# Altium project TS_23 Dashboard Breakout Board.PrjPcb
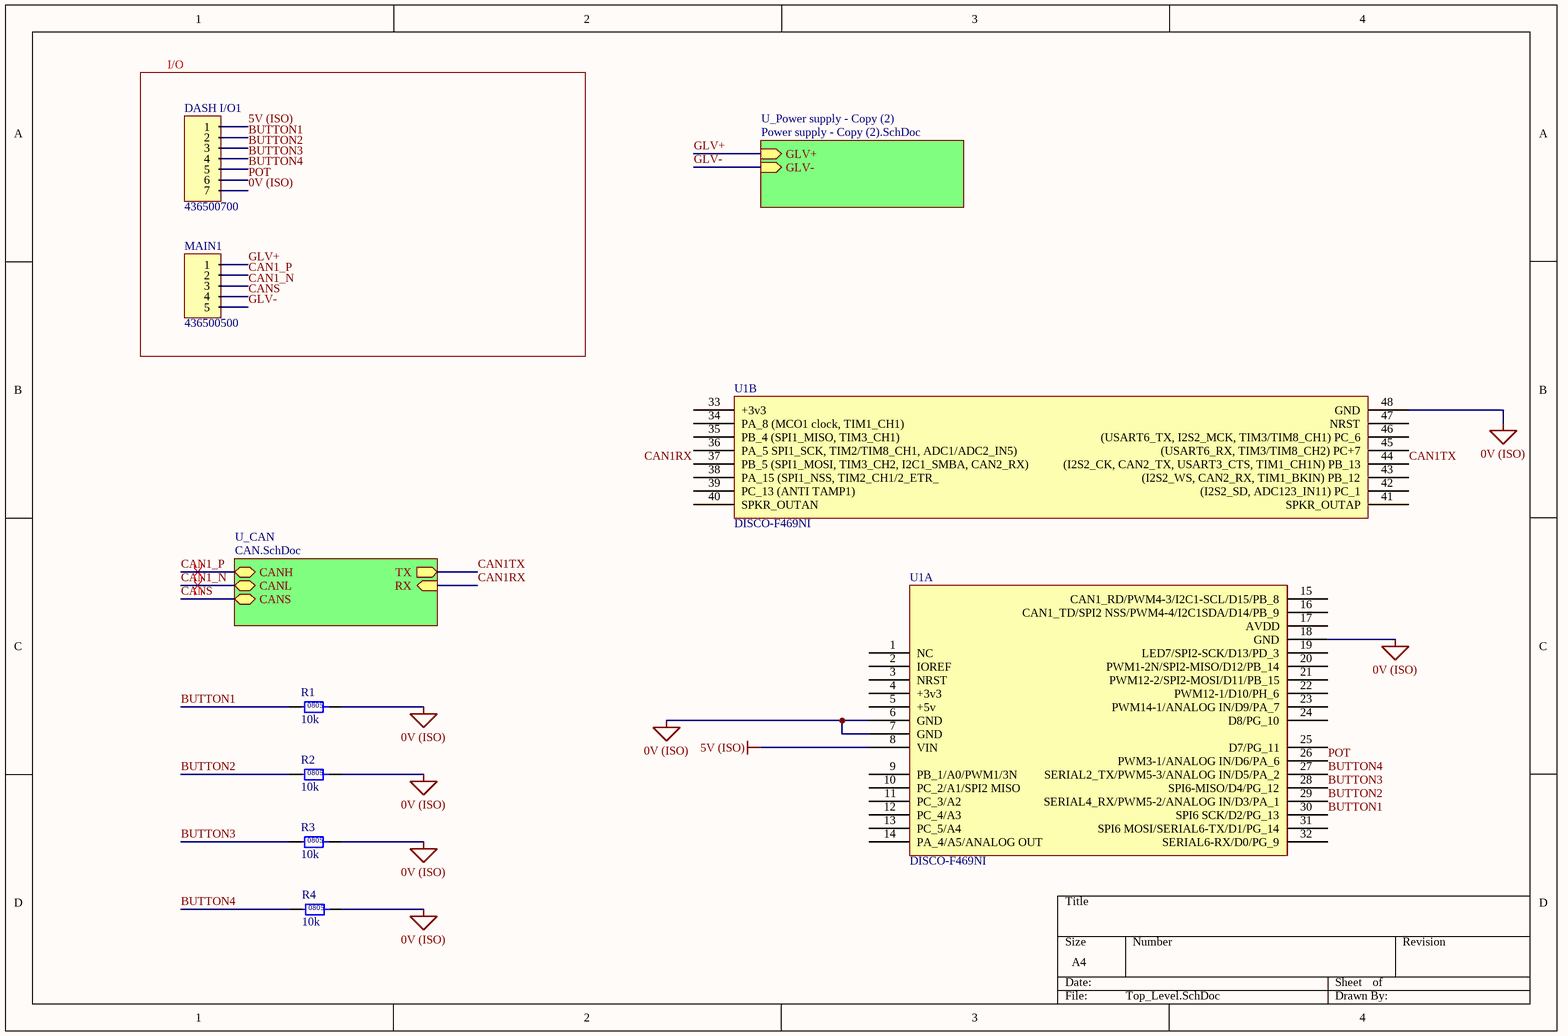
[diagram p0: Top_Level.SchDoc]
3 sheets, 55 parts. Net scope: hierarchical (ports join the sheet entries above them; power ports are global).
Board file: PCB.PcbDoc
Sheets:
  Top_Level.SchDoc
    U_CAN = CAN.SchDoc
    U_Power supply - Copy (2) = Power supply - Copy (2).SchDoc

## Sheet Top_Level.SchDoc
size A4; SheetNumber: 1; SheetTotal: 3

### Parts
DASH_I/O1  436500700  [436500700]
MAIN1  436500500  [436500500]
R1  10k  [0805]
R2  10k  [0805]
R3  10k  [0805]
R4  10k  [0805]
U1  DISCO-F469NI  [DISCO-F469NI]  (parts A,B of 2)

### Blocks framed on the sheet
I/O: DASH_I/O1 MAIN1

### Sub-sheets
U_CAN = CAN.SchDoc: CANH (bidir), CANL (bidir), CANS (bidir), RX (in), TX (out)
U_Power supply - Copy (2) = Power supply - Copy (2).SchDoc: GLV+ (in), GLV- (in)

### Nets
0V (ISO): DASH_I/O1.7 R1.2 R2.2 R3.2 R4.2 U1.6(GND) U1.7(GND) U1.18(GND) U1.48(GND)
5V (ISO): DASH_I/O1.1 U1.8(VIN)
BUTTON1: DASH_I/O1.2 R1.1 U1.30(SPI6_SCK/D2/PG_13)
BUTTON2: DASH_I/O1.3 R2.1 U1.29(SERIAL4_RX/PWM5-2/ANALOG_IN/D3/PA_1)
BUTTON3: DASH_I/O1.4 R3.1 U1.28(SPI6-MISO/D4/PG_12)
BUTTON4: DASH_I/O1.5 R4.1 U1.27(SERIAL2_TX/PWM5-3/ANALOG_IN/D5/PA_2)
CAN1_N: MAIN1.3 ; sheet U_CAN/CANL
CAN1_P: MAIN1.2 ; sheet U_CAN/CANH
CAN1RX: U1.37(PB_5_(SPI1_MOSI,_TIM3_CH2,_I2C1_SMBA,_CAN2_RX)) ; sheet U_CAN/RX
CAN1TX: U1.44((I2S2_CK,_CAN2_TX,_USART3_CTS,_TIM1_CH1N)_PB_13) ; sheet U_CAN/TX
CANS: MAIN1.4 ; sheet U_CAN/CANS
GLV+: MAIN1.1 ; sheet U_Power supply - Copy (2)/GLV+
GLV-: MAIN1.5 ; sheet U_Power supply - Copy (2)/GLV-
POT: DASH_I/O1.6 U1.26(PWM3-1/ANALOG_IN/D6/PA_6)

Not connected (* = marked no-connect by the designer): U1 1(NC) 2(IOREF) 3(NRST) 4(+3v3) 5(+5v) 9(PB_1/A0/PWM1/3N) 10(PC_2/A1/SPI2_MISO) 11(PC_3/A2) 12(PC_4/A3) 13(PC_5/A4) 14(PA_4/A5/ANALOG_OUT) 15(CAN1_RD/PWM4-3/I2C1-SCL/D15/PB_8) 16(CAN1_TD/SPI2_NSS/PWM4-4/I2C1SDA/D14/PB_9) 17(AVDD) 19(LED7/SPI2-SCK/D13/PD_3) 20(PWM1-2N/SPI2-MISO/D12/PB_14) 21(PWM12-2/SPI2-MOSI/D11/PB_15) 22(PWM12-1/D10/PH_6) 23(PWM14-1/ANALOG_IN/D9/PA_7) 24(D8/PG_10) 25(D7/PG_11) 31(SPI6_MOSI/SERIAL6-TX/D1/PG_14) 32(SERIAL6-RX/D0/PG_9) 33(+3v3) 34(PA_8_(MCO1_clock,_TIM1_CH1)) 35(PB_4_(SPI1_MISO,_TIM3_CH1)) 36(PA_5_SPI1_SCK,_TIM2/TIM8_CH1,_ADC1/ADC2_IN5)) 38(PA_15_(SPI1_NSS,_TIM2_CH1/2_ETR_) 39(PC_13_(ANTI_TAMP1)) 40(SPKR_OUTAN) 41(SPKR_OUTAP) 42((I2S2_SD,_ADC123_IN11)_PC_1) 43((I2S2_WS,_CAN2_RX,_TIM1_BKIN)_PB_12) 45((USART6_RX,_TIM3/TIM8_CH2)_PC+7) 46((USART6_TX,_I2S2_MCK,_TIM3/TIM8_CH1)_PC_6) 47(NRST)

### Layout directives
differential pair: CAN1_N, CAN1_P

### Notes on the sheet
- (in symbol RC0805FR0710KL) 0805

### Library data of the parts
DASH_I/O1 = 436500700: Micro-Fit 7x1; Positions: 7; Pitch: 3.0mm; Angle: 90; Flange: No; Contact: Tin; Part Number: 436500700; Row Spacing: 3.0mm; Digikey Part Number: WM2423-ND; Digikey Link: https://www.digikey.com.au/en/products/detail/molex/0436500700/531339
MAIN1 = 436500500: Micro-Fit 5x1; Positions: 5; Pitch: 3.0mm; Angle: 90; Flange: No; Contact: Tin; Part Number: 436500500; Row Spacing: 3.0mm; Digikey Part Number: WM1863-ND; Digikey Link: https://www.digikey.com.au/en/products/detail/molex/0436500500/268992
R1-R4 = RC0805FR0710KL: Manufacturer: YAGEO; Tolerance: 0.01; Rated Power: 0.125W; Part Number: RC0805FR0710KL; Value: 10k; Material: FR-07; Digikey Part Number: 311-10.0KCRCT-ND
U1 = DISCO-F469NI: STM32F469 Discovery STM32F4 ARM® Cortex®-M4 MCU 32-Bit Embedded Evaluation Board  (The Disco 69 lol); Manufacturer: STMicroelectronics; Part Number: DISCO-F469NI; Digikey Part Number: 497-15990-ND; Digikey Link: https://www.digikey.com/product-detail/en/stmicroelectronics/STM32F469I-DISCO/497-15990-ND/5428811

## Sheet CAN.SchDoc
size A4; SheetNumber: 3; SheetTotal: 2
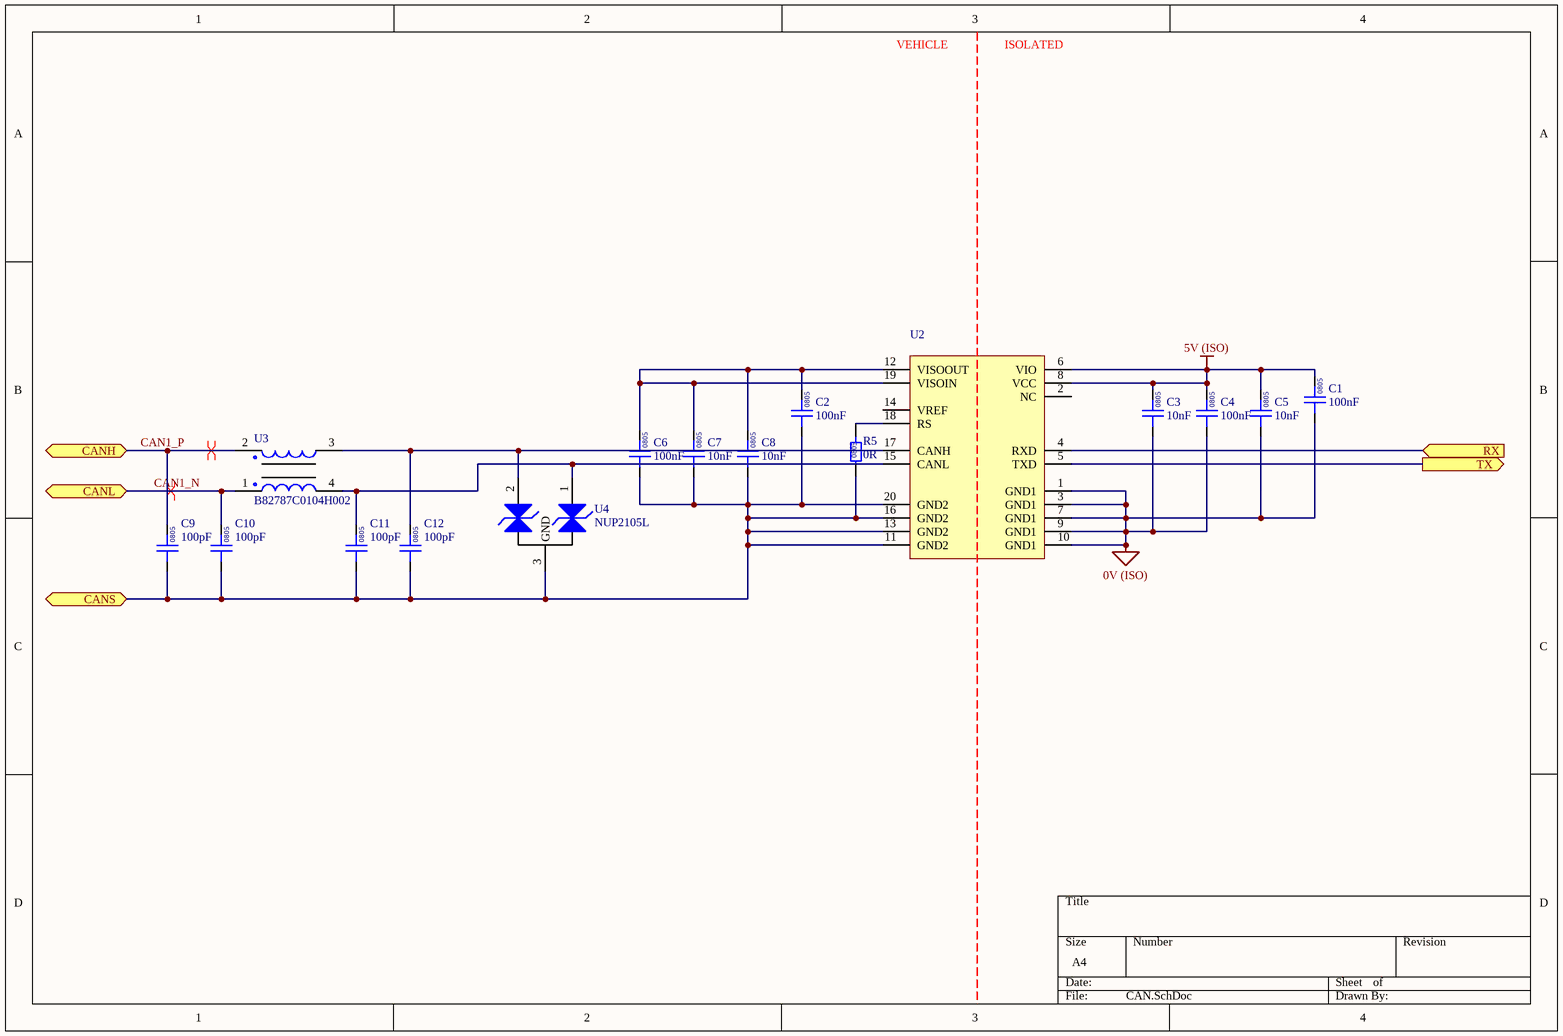
[diagram p1: CAN.SchDoc]

### Parts
C1  100nF  [0805]
C2  100nF  [0805]
C3  10nF  [0805]
C4  100nF  [0805]
C5  10nF  [0805]
C6  100nF  [0805]
C7  10nF  [0805]
C8  10nF  [0805]
C9  100pF  [0805]
C10  100pF  [0805]
C11  100pF  [0805]
C12  100pF  [0805]
R5  0R  [0805]
U2  (no value)  [AD SOIC-W 20]
U3  B82787C0104H002  [TDK 4-PC Pad]
U4  NUP2105L  [ON SOT-23]

### Ports
CANH (bidir), CANL (bidir), CANS (bidir), RX (in), TX (out)

### Nets
0V (ISO): C1.1 C3.1 C4.1 C5.1 U2.1(GND1) U2.3(GND1) U2.7(GND1) U2.9(GND1) U2.10(GND1)
5V (ISO): C1.2 C3.2 C4.2 C5.2 U2.6(VIO) U2.8(VCC)
CAN1_N: C10.2 U3.1 ; port CANL
CAN1_P: C9.2 U3.2 ; port CANH
CAN1RX: U2.4(RXD) ; port RX
CAN1TX: U2.5(TXD) ; port TX
CANS: C2.1 C6.1 C7.1 C8.1 C9.1 C10.1 C11.1 C12.1 R5.1 U2.11(GND2) U2.13(GND2) U2.16(GND2) U2.20(GND2) U4.3(GND) ; port CANS
NetC2_2: C2.2 C6.2 C7.2 C8.2 U2.12(VISOOUT) U2.19(VISOIN)
NetC11_2: C11.2 U2.15(CANL) U3.4 U4.1(CAN_H)
NetC12_2: C12.2 U2.17(CANH) U3.3 U4.2(CAN_L)
NetR5_2: R5.2 U2.18(RS)

Not connected (* = marked no-connect by the designer): U2 2(NC) 14(VREF)

### Layout directives
differential pair: CAN1_N, CAN1_P

### Notes on the sheet
- VEHICLE
- ISOLATED
- (in symbol GCM21BR71H104KA37L) 0805
- (in symbol GCM2165C1H101JA16D) 0805
- (in symbol GCM2195C1H103JA16D) 0805
- (in symbol RC0805FR070RL) 0805

### Library data of the parts
C1 C2 C4 C6 = GCM21BR71H104KA37L: Manufacturer: muRata; Tolerance: ±10%; Material: MLCC; Rated Voltage: 50V; Temperature Rating: X7R; Part Number: GCM21BR71H104KA37L; Value: 100nF; Digikey Part Number: 490-6064-1-ND
C3 C5 C7 C8 = GCM2195C1H103JA16D: Manufacturer: muRata; Tolerance: ±5%; Material: MLCC; Rated Voltage: 50V; Temperature Rating: C0G, NP0; Part Number: GCM2195C1H103JA16D; Value: 10nF; Digikey Part Number: 490-4783-1-ND
C9-C12 = GCM2165C1H101JA16D: Manufacturer: muRata; Tolerance: ±5%; Material: MLCC; Rated Voltage: 50V; Temperature Rating: C0G, NP0; Part Number: GCM2165C1H101JA16D; Value: 100pF; Digikey Part Number: 490-8031-1-ND
R5 = RC0805FR070RL: Manufacturer: YAGEO; Tolerance: 0.01; Rated Power: 0.125W; Part Number: RC0805FR070RL; Value: 0R; Material: FR-07; Digikey Part Number: 311-0.0CRCT-ND
U2 = ADM3053: Isolated CAN Transceiver; Manufacturer: Analogue Devices; Part Number: ADM3053; Digikey Part Number: ADM3053BRWZ-ND; Digikey Link: https://www.digikey.com/product-detail/en/analog-devices-inc/ADM3053BRWZ/ADM3053BRWZ-ND/2709332
U3 = B82787C0104H002: Manufacturer: EPCOS (TDK); Value: 100µH @ 100kHz; Impedance: 5.8 kOhms @ 10MHz; Rated Current: 150mA; Part Number: B82787C0104H002; Material: Wirewound; Digikey Part Number: 495-4598-1-ND
U4 = NUP2105L: Dual Line CAN Bus Protector; Manufacturer: ON Semiconductor; Part Number: NUP2105L; Digikey Part Number: NUP2105LT1GOSCT-ND; Digikey Link: https://www.digikey.com/product-detail/en/on-semiconductor/NUP2105LT1G/NUP2105LT1GOSCT-ND/1485001

## Sheet Power supply - Copy (2).SchDoc
size A4; SheetNumber: 2; SheetTotal: 3
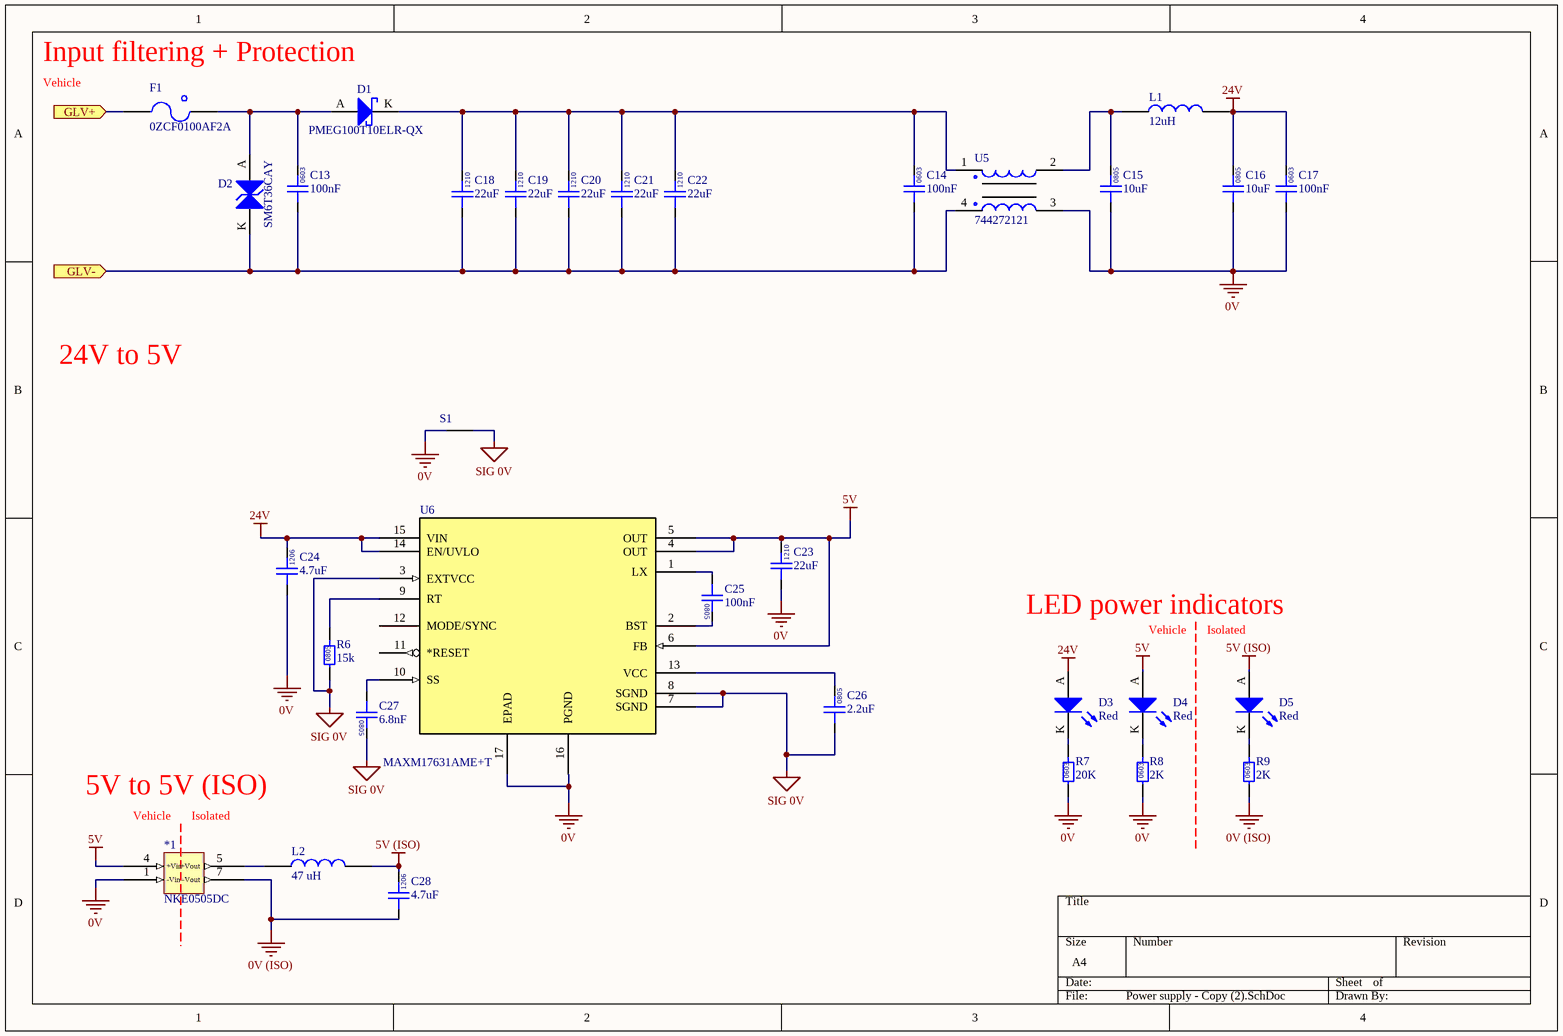
[diagram p2: Power supply - Copy (2).SchDoc]

### Parts
*1  NKE0505DC  [NKE0505DC]
C13  100nF  [0603]
C14  100nF  [0603]
C15  10uF  [0805]
C16  10uF  [0805]
C17  100nF  [0603]
C18  22uF  [1210]
C19  22uF  [1210]
C20  22uF  [1210]
C21  22uF  [1210]
C22  22uF  [1210]
C23  22uF  [1210]
C24  4.7uF  [1206 CAP]
C25  100nF  [0805]
C26  2.2uF  [0805]
C27  6.8nF  [0805]
C28  4.7uF  [1206 CAP]
D1  PMEG100T10ELR-QX  [NXP SOD123W]
D2  SM6T36CAY  [ST SMB DIODE]
D3  Red  [0805 LED]
D4  Red  [0805 LED]
D5  Red  [0805 LED]
F1  0ZCF0100AF2A  [2920]
L1  12uH  [1812]
L2  47 uH  [82473C]
R6  15k  [0805]
R7  20K  [0603]
R8  2K  [0603]
R9  2K  [0603]
S1  (no value)  [POINT_0_1]  (net tie, no BOM)
U5  744272121  [Wurth 4-PC Pad]
U6  MAXM17631AME+T  [MAXM17631AME+T]

### Ports
GLV+ (in), GLV- (in)

### Nets
0V: *1.1(-Vin) C15.1 C16.1 C17.1 C23.1 C24.1 R7.1 R8.1 S1.1 U5.3 U6.16(PGND) U6.17(EPAD)
0V (ISO): *1.7(-Vout) C28.1 R9.1
5V: *1.4(+Vin) C23.2 D4.A U6.4(OUT) U6.5(OUT) U6.6(FB)
5V (ISO): C28.2 D5.A L2.1
24V: C16.2 C17.2 C24.2 D3.A L1.1 U6.14(EN/UVLO) U6.15(VIN)
SIG 0V: C26.1 C27.2 R6.1 S1.2 U6.3(EXTVCC) U6.7(SGND) U6.8(SGND)
GLV+: F1.1 ; port GLV+
GLV-: C13.1 C14.1 C18.1 C19.1 C20.1 C21.1 C22.1 D2.K U5.4 ; port GLV-
Net*1_5: *1.5(+Vout) L2.2
NetC13_2: C13.2 D1.A D2.A F1.2
NetC14_2: C14.2 C18.2 C19.2 C20.2 C21.2 C22.2 D1.K U5.1
NetC15_2: C15.2 L1.2 U5.2
NetC25_1: C25.1 U6.1(LX)
NetC25_2: C25.2 U6.2(BST)
NetC26_2: C26.2 U6.13(VCC)
NetC27_1: C27.1 U6.10(SS)
NetD3_K: D3.K R7.2
NetD4_K: D4.K R8.2
NetD5_K: D5.K R9.2
NetR6_2: R6.2 U6.9(RT)

Not connected (* = marked no-connect by the designer): U6 11(*RESET) 12(MODE/SYNC)

### Notes on the sheet
- Input filtering + Protection
- Vehicle
- 24V to 5V
- Star point grounding for signal GND
- LED power indicators
- Isolated
- (near U6) Css (soft start capacitor) tss = (Css/(5.55*10^-6)) = 1.225ms
- 5V to 5V (ISO)
- (near *1) Vehicle
- (in symbol GCM21BR71H104KA37L) 0805
- (in symbol GCM188L81H104KA57D) 0603
- (in symbol GCM2195C1H682JA16D) 0805
- (in symbol GRM21BR6YA106KE43L) 0805
- (in symbol GRM21BR71E225KE11L) 0805
- (in symbol GRM31CR71H475KA12K) 1206
- (in symbol GRM32ER71E226KE15L) 1210
- (in symbol RC0603FR-072KL) 0603
- (in symbol RC0603FR-0720KL) 0603
- (in symbol RC0805FR0715KL) 0805

### Library data of the parts
*1 = NKE0505DC: DC DC CONVERTER 5V 1W; Manufacturer: Murata Power Solutions Inc.; Input Voltage: 4.5 to 5.5; Output Current: 200 mA; Part Number: NKE0505DC; Output Voltage: 5V; Digikey Part Number: 811-1433-5-ND
C13 C14 C17 = GCM188L81H104KA57D: Manufacturer: muRata; Rated Voltage: 50V; Tolerance: ±10%; Material: MLCC; Temperature Rating: X8L; Part Number: GCM188L81H104KA57D; Value: 100nF; Digikey Part Number: 490-6049-1-ND
C15 C16 = GRM21BR6YA106KE43L: Manufacturer: muRata; Rated Voltage: 50V; Tolerance: 10%; Material: MLCC; Temperature Rating: X5R; Part Number: GRM21BR6YA106KE43L; Value: 10uF; Digikey Part Number: 490-10514-6-ND
C18-C23 = GRM32ER71E226KE15L: Manufacturer: Murata Electronics; Rated Voltage: 25V; Tolerance: ±10%; Material: MLCC; Temperature Rating: X7R; Part Number: GRM32ER71E226KE15L; Value: 22uF; Digikey Part Number: 490-5313-2-ND
C24 C28 = GRM31CR71H475KA12K: Manufacturer: Murata Electronics; Rated Voltage: 50V; Tolerance: ±10%; Material: MLCC; Temperature Rating: X7R; Part Number: GRM31CR71H475KA12K; Value: 4.7uF; Digikey Part Number: 490-GRM31CR71H475KA12KTR-ND
C25 = GCM21BR71H104KA37L: Manufacturer: muRata; Rated Voltage: 50V; Tolerance: ±10%; Material: MLCC; Temperature Rating: X7R; Part Number: GCM21BR71H104KA37L; Value: 100nF; Digikey Part Number: 490-6064-1-ND
C26 = GRM21BR71E225KE11L: Manufacturer: Murata Electronics; Rated Voltage: 25V; Tolerance: ±10%; Material: MLCC; Temperature Rating: X7R; Part Number: GRM21BR71E225KE11L; Value: 2.2uF; Digikey Part Number: 490-14467-2-ND
C27 = GCM2195C1H682JA16D: Manufacturer: muRata; Rated Voltage: 50V; Tolerance: ±5%; Material: MLCC; Temperature Rating: C0G, NP0; Part Number: GCM2195C1H682JA16D; Value: 6.8nF; Digikey Part Number: 490-4974-1-ND
D1 = PMEG100T10ELR-QX: Manufacturer: Nexperia USA Inc.; Forward Voltage: 0.75 V @ 1A; Breakdown Voltage: 100 V; Rated Power: 680 mW; Part Number: PMEG100T10ELR-QX; Digikey Part Number: 1727-PMEG100T10ELR-QXCT-ND
D2 = SM6T36CAY: Manufacturer: STMicroelectronics; Forward Voltage: 30.8 V; Rated Power: 600W; Part Number: SM6T36CAY; Breakdown Voltage: 30.8 V; Digikey Part Number: 497-10804-1-ND
D3-D5 = SML-210LTT86: Red LED Indication - Discrete 1.75V 0805 (2012 Metric); Manufacturer: ROHM Semiconductor; Part Number: SML-210LTT86; Colour: Red; Digikey Part Number: 511-1286-1-ND
F1 = 0ZCF0100AF2A: PTC RESET FUSE 60V 1A 292; Manufacturer: Littelfuse Inc.; Part Number: 0ZCF0100AF2A; Digikey Part Number: 507-2070-1-ND; Digikey Link: https://www.digikey.com/product-detail/en/bel-fuse-inc/0ZCF0100AF2A/507-2070-1-ND/6210547
L1 = RLS-126: Manufacturer: Recom; Tolerance: 0.2; Material: Wirewound; Impedance: 230mOhm; Rated Current: 0.8 A; Part Number: RLS-126; Value: 12uH; Digikey Part Number: 945-3429-ND
L2 = 82473C: Manufacturer: Murata Power Solutions Inc.; Tolerance: 0.1; Impedance: 1.69 Ohms; Rated Current: 250mA; Material: Wirewound; Part Number: 82473C; Value: 47 uH; Digikey Part Number: 811-2477-2-ND
R6 = RC0805FR0715KL: Manufacturer: YAGEO; Tolerance: 0.01; Rated Power: 0.125W; Part Number: RC0805FR0715KL; Value: 15k; Material: FR-07; Digikey Part Number: 311-15.0KCRCT-ND
R7 = RC0603FR-0720KL: Manufacturer: YAGEO; Tolerance: 0.01; Rated Power: 0.1W; Part Number: RC0603FR-0720KL; Value: 20K; Digikey Part Number: 311-20.0KHRCT-ND
R8 R9 = RC0603FR-072KL: Manufacturer: YAGEO; Tolerance: 0.01; Rated Power: 0.1W; Part Number: RC0603FR-072KL; Value: 2K; Digikey Part Number: 311-2.00KHRCT-ND
S1 = STAR_POINT_0.1: Value: 0.1; Part Number: STAR_POINT_0.1
U5 = 744272121: Manufacturer: Wurth Electronics Inc; Value: 120uH @ 100kHz; Impedance: 460 Ohms @ 30MHz; Rated Current: 2.5 A; Part Number: 744272121; Material: Wirewound; Digikey Part Number: 732-1489-1-ND
U6 = MAXM17631AME+T: DC DC CONVERTER 5V; Mfr_Name: Analog Devices Inc; Manufacturer: Analog Devices; Input Voltage: 4.5 to 36 V; Output Current: 1.0 A; Digi-Key_Part_Number_1: 175-MAXM17631AME+TTR-ND; RefDes: RefDes; Type: Type; Part Number: MAXM17631AME+T; Output Voltage: 5V; Digikey Part Number: 175-MAXM17631AME+TTR-ND

## Nets that join several sheets
0V (ISO): Top_Level (9 pins), CAN (9 pins), Power supply - Copy (2) (*1.7 C28.1 R9.1)
5V (ISO): Top_Level (DASH_I/O1.1 U1.8), CAN (6 pins), Power supply - Copy (2) (C28.2 D5.A L2.1)
CAN1_N: Top_Level (MAIN1.3), CAN (C10.2 U3.1)
CAN1_P: Top_Level (MAIN1.2), CAN (C9.2 U3.2)
CAN1RX: Top_Level (U1.37), CAN (U2.4)
CAN1TX: Top_Level (U1.44), CAN (U2.5)
CANS: Top_Level (MAIN1.4), CAN (14 pins)
GLV+: Top_Level (MAIN1.1), Power supply - Copy (2) (F1.1)
GLV-: Top_Level (MAIN1.5), Power supply - Copy (2) (9 pins)